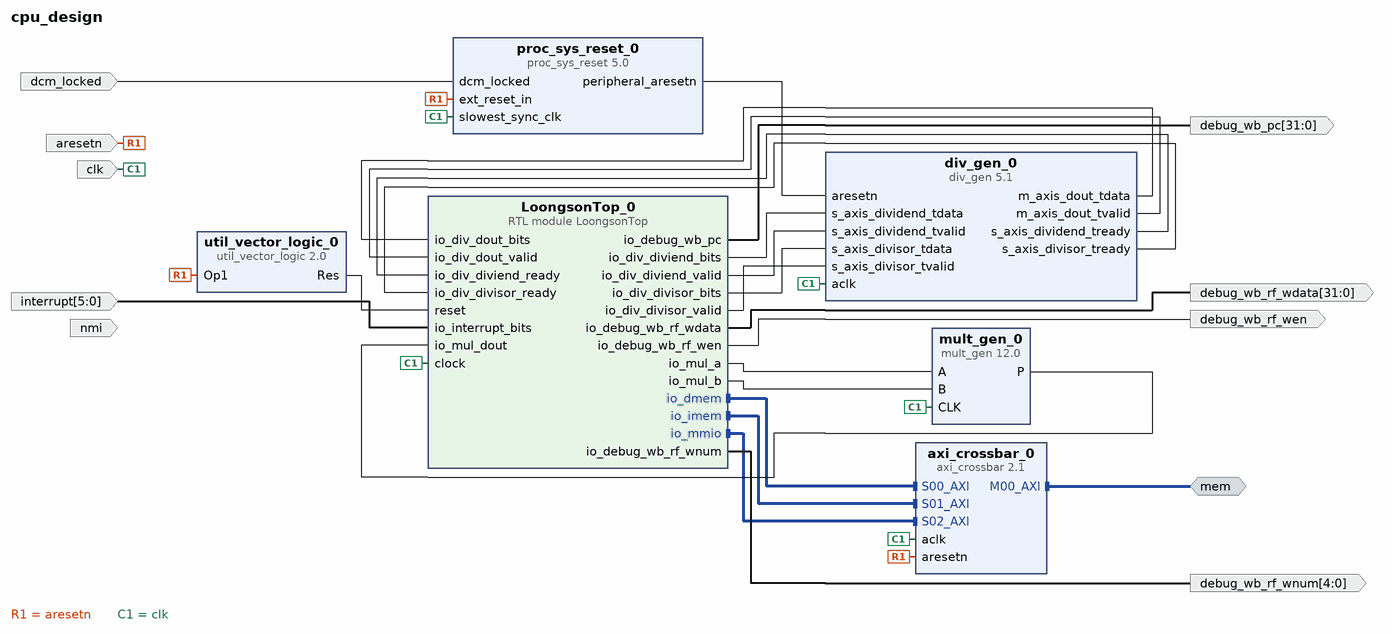
[diagram p0: block diagram of the top level]
# Vivado block design cpu_design, xc7a200tfbg676-2, Vivado 2018.1
create_bd_design cpu_design

create_bd_intf_port -mode Master -vlnv xilinx.com:interface:aximm_rtl:1.0 mem
set_property -dict [list \
  CONFIG.DATA_WIDTH 32 \
  CONFIG.PROTOCOL AXI4 \
  CONFIG.ADDR_WIDTH 32 \
  CONFIG.CLK_DOMAIN cpu_design_clk \
] [get_bd_intf_ports mem]
create_bd_port -dir I -from 5 -to 0 interrupt
create_bd_port -dir I nmi
create_bd_port -dir O -from 31 -to 0 debug_wb_pc
create_bd_port -dir O -from 31 -to 0 debug_wb_rf_wdata
create_bd_port -dir O debug_wb_rf_wen
create_bd_port -dir O -from 4 -to 0 debug_wb_rf_wnum
create_bd_port -dir I -type rst aresetn
set_property -dict {CONFIG.POLARITY ACTIVE_LOW} [get_bd_ports aresetn]
create_bd_port -dir I -type clk clk
set_property -dict {CONFIG.ASSOCIATED_BUSIF mem CONFIG.ASSOCIATED_RESET aresetn} [get_bd_ports clk]
create_bd_port -dir I dcm_locked

create_bd_cell -type module -reference LoongsonTop LoongsonTop_0
create_bd_cell -type ip -vlnv xilinx.com:ip:axi_crossbar:2.1 axi_crossbar_0
set_property -dict [list \
  CONFIG.NUM_SI 3 \
  CONFIG.NUM_MI 1 \
  CONFIG.CONNECTIVITY_MODE SASD \
  CONFIG.R_REGISTER 1 \
  CONFIG.S01_BASE_ID 0x00000008 \
  CONFIG.S02_BASE_ID 0x00000010 \
  CONFIG.S03_BASE_ID 0x00000018 \
  CONFIG.S04_BASE_ID 0x00000020 \
  CONFIG.S05_BASE_ID 0x00000028 \
  CONFIG.S06_BASE_ID 0x00000030 \
  CONFIG.S07_BASE_ID 0x00000038 \
  CONFIG.S08_BASE_ID 0x00000040 \
  CONFIG.S09_BASE_ID 0x00000048 \
  CONFIG.S10_BASE_ID 0x00000050 \
  CONFIG.S11_BASE_ID 0x00000058 \
  CONFIG.S12_BASE_ID 0x00000060 \
  CONFIG.S13_BASE_ID 0x00000068 \
  CONFIG.S14_BASE_ID 0x00000070 \
  CONFIG.S15_BASE_ID 0x00000078 \
] [get_bd_cells axi_crossbar_0]
create_bd_cell -type ip -vlnv xilinx.com:ip:div_gen:5.1 div_gen_0
set_property -dict [list \
  CONFIG.dividend_and_quotient_width 40 \
  CONFIG.divisor_width 40 \
  CONFIG.fractional_width 40 \
  CONFIG.clocks_per_division 8 \
  CONFIG.FlowControl Blocking \
  CONFIG.OptimizeGoal Resources \
  CONFIG.latency 46 \
  CONFIG.ARESETN true \
] [get_bd_cells div_gen_0]
create_bd_cell -type ip -vlnv xilinx.com:ip:mult_gen:12.0 mult_gen_0
set_property -dict [list \
  CONFIG.PortAType Signed \
  CONFIG.PortAWidth 33 \
  CONFIG.PortBWidth 33 \
  CONFIG.Multiplier_Construction Use_Mults \
  CONFIG.OptGoal Area \
  CONFIG.PipeStages 3 \
] [get_bd_cells mult_gen_0]
create_bd_cell -type ip -vlnv xilinx.com:ip:proc_sys_reset:5.0 proc_sys_reset_0
create_bd_cell -type ip -vlnv xilinx.com:ip:util_vector_logic:2.0 util_vector_logic_0
set_property -dict {CONFIG.C_SIZE 1 CONFIG.C_OPERATION not} [get_bd_cells util_vector_logic_0]

# ---- connections ----

connect_bd_intf_net [get_bd_intf_pins LoongsonTop_0/io_dmem] [get_bd_intf_pins axi_crossbar_0/S00_AXI]
connect_bd_intf_net [get_bd_intf_pins LoongsonTop_0/io_imem] [get_bd_intf_pins axi_crossbar_0/S01_AXI]
connect_bd_intf_net [get_bd_intf_pins LoongsonTop_0/io_mmio] [get_bd_intf_pins axi_crossbar_0/S02_AXI]
connect_bd_intf_net [get_bd_intf_ports mem] [get_bd_intf_pins axi_crossbar_0/M00_AXI]
connect_bd_net [get_bd_pins LoongsonTop_0/io_debug_wb_pc] [get_bd_ports debug_wb_pc]
connect_bd_net [get_bd_pins LoongsonTop_0/io_debug_wb_rf_wdata] [get_bd_ports debug_wb_rf_wdata]
connect_bd_net [get_bd_pins LoongsonTop_0/io_debug_wb_rf_wen] [get_bd_ports debug_wb_rf_wen]
connect_bd_net [get_bd_pins LoongsonTop_0/io_debug_wb_rf_wnum] [get_bd_ports debug_wb_rf_wnum]
connect_bd_net [get_bd_pins LoongsonTop_0/io_div_diviend_bits] [get_bd_pins div_gen_0/s_axis_dividend_tdata]
connect_bd_net [get_bd_pins LoongsonTop_0/io_div_diviend_valid] [get_bd_pins div_gen_0/s_axis_dividend_tvalid]
connect_bd_net [get_bd_pins LoongsonTop_0/io_div_divisor_bits] [get_bd_pins div_gen_0/s_axis_divisor_tdata]
connect_bd_net [get_bd_pins LoongsonTop_0/io_div_divisor_valid] [get_bd_pins div_gen_0/s_axis_divisor_tvalid]
connect_bd_net [get_bd_pins LoongsonTop_0/io_mul_a] [get_bd_pins mult_gen_0/A]
connect_bd_net [get_bd_pins LoongsonTop_0/io_mul_b] [get_bd_pins mult_gen_0/B]
connect_bd_net [get_bd_ports aresetn] \
  [get_bd_pins axi_crossbar_0/aresetn] [get_bd_pins proc_sys_reset_0/ext_reset_in] [get_bd_pins util_vector_logic_0/Op1]
connect_bd_net [get_bd_ports clk] \
  [get_bd_pins LoongsonTop_0/clock] [get_bd_pins axi_crossbar_0/aclk] [get_bd_pins div_gen_0/aclk] \
  [get_bd_pins mult_gen_0/CLK] [get_bd_pins proc_sys_reset_0/slowest_sync_clk]
connect_bd_net [get_bd_ports dcm_locked] [get_bd_pins proc_sys_reset_0/dcm_locked]
connect_bd_net [get_bd_pins div_gen_0/m_axis_dout_tdata] [get_bd_pins LoongsonTop_0/io_div_dout_bits]
connect_bd_net [get_bd_pins div_gen_0/m_axis_dout_tvalid] [get_bd_pins LoongsonTop_0/io_div_dout_valid]
connect_bd_net [get_bd_pins div_gen_0/s_axis_dividend_tready] [get_bd_pins LoongsonTop_0/io_div_diviend_ready]
connect_bd_net [get_bd_pins div_gen_0/s_axis_divisor_tready] [get_bd_pins LoongsonTop_0/io_div_divisor_ready]
connect_bd_net [get_bd_pins mult_gen_0/P] [get_bd_pins LoongsonTop_0/io_mul_dout]
connect_bd_net [get_bd_pins proc_sys_reset_0/peripheral_aresetn] [get_bd_pins div_gen_0/aresetn]
connect_bd_net [get_bd_pins util_vector_logic_0/Res] [get_bd_pins LoongsonTop_0/reset]
connect_bd_net [get_bd_ports interrupt] [get_bd_pins LoongsonTop_0/io_interrupt_bits]

# ---- address map ----
assign_bd_address -offset 0x00000000 -range 4G -target_address_space [get_bd_addr_spaces LoongsonTop_0/io_dmem] [get_bd_addr_segs mem/Reg]
assign_bd_address -offset 0x00000000 -range 4G -target_address_space [get_bd_addr_spaces LoongsonTop_0/io_imem] [get_bd_addr_segs mem/Reg]
assign_bd_address -offset 0x00000000 -range 4G -target_address_space [get_bd_addr_spaces LoongsonTop_0/io_mmio] [get_bd_addr_segs mem/Reg]

validate_bd_design
save_bd_design
